# Altium schematic sheet Propulsion_v2.SchDoc
size A4
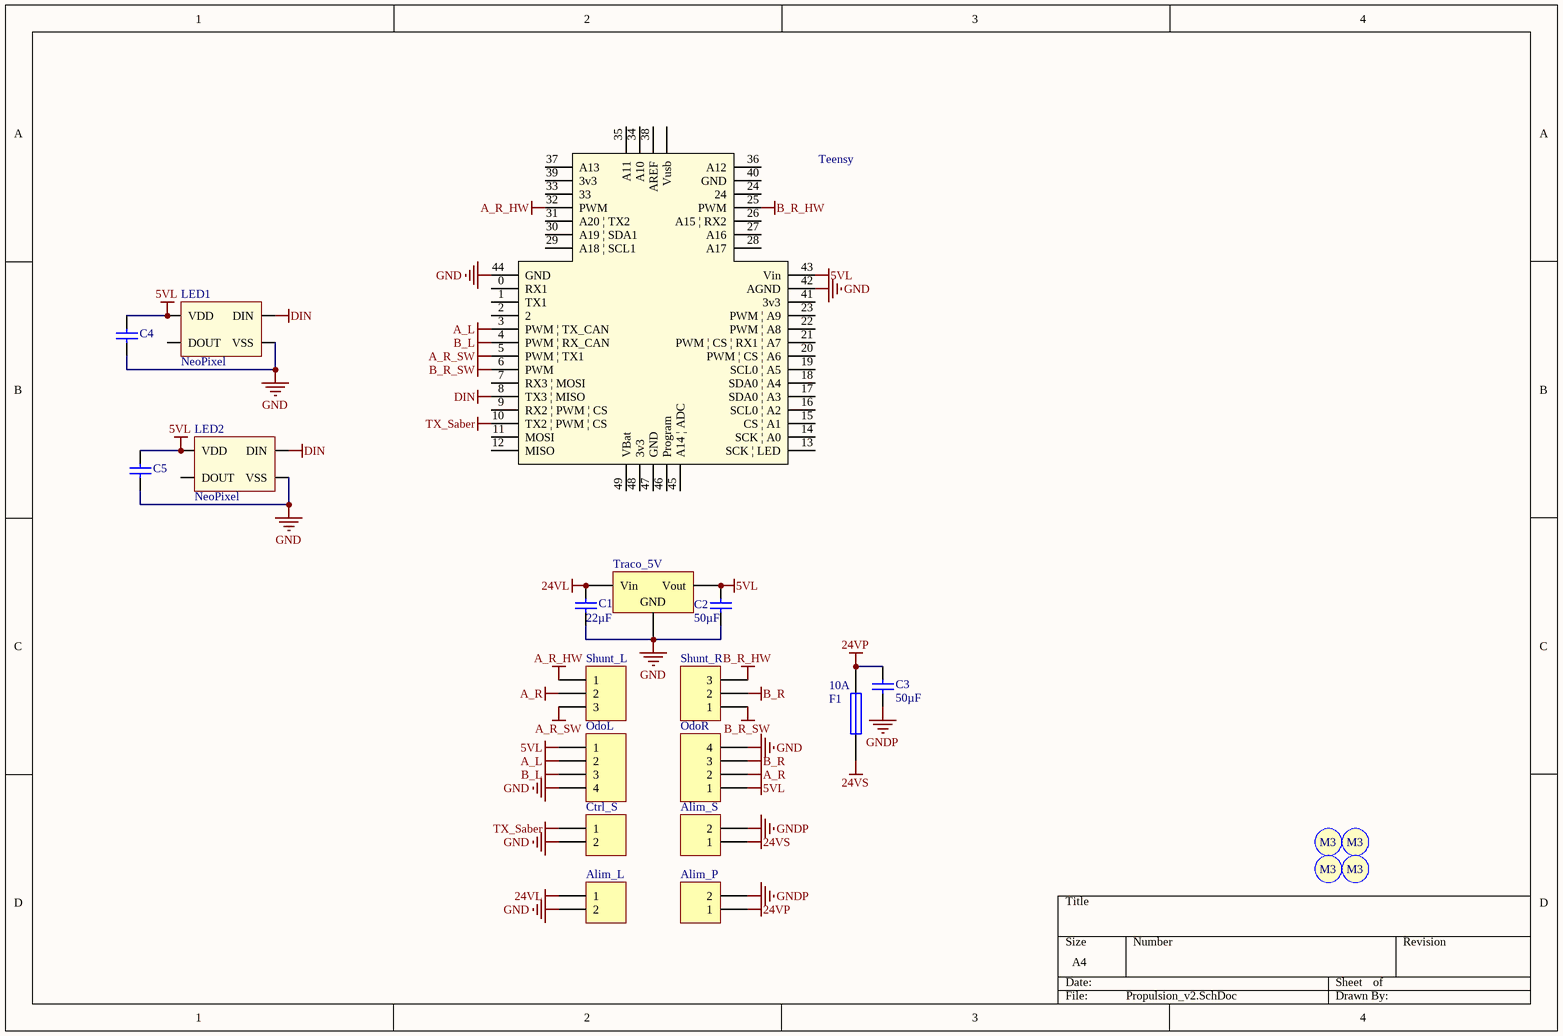
[diagram p0: Propulsion_v2.SchDoc]

## Parts
Alim_L  Minifit Jr 2x1H  [Molex_MiniFitJr_2x1H]  (value not drawn)
Alim_P  Minifit Jr 2x1H  [Molex_MiniFitJr_2x1H]  (value not drawn)
Alim_S  Minifit Jr 2x1H  [Molex_MiniFitJr_2x1H]  (value not drawn)
C1  value 22µF  [3.2X1.6X1.1]  (hidden comment: Cap22uF)
C2  value 50µF  [3.2X1.6X1.1]  (hidden comment: Cap50uF)
C3  value 50µF  [Condensateur]  (hidden comment: Cap50uF)
C4  Cap  [3.2X1.6X1.1]  (value not drawn)
C5  Cap  [3.2X1.6X1.1]  (value not drawn)
Ctrl_S  SPOX 2x1H  [Molex SPOX 2x1H]  (value not drawn)
F1  10A  [Fuse]
LED1  NeoPixel  [Neopixel]
LED2  NeoPixel  [Neopixel]
OdoL  SPOX 4x1H  [Molex SPOX 4x1H]  (value not drawn)
OdoR  SPOX 4x1H  [Molex SPOX 4x1H]  (value not drawn)
S1  Screw M3  [Screw M3]  (value not drawn)
S2  Screw M3  [Screw M3]  (value not drawn)
S3  Screw M3  [Screw M3]  (value not drawn)
S4  Screw M3  [Screw M3]  (value not drawn)
Shunt_L  Shunt selector  [HDR1X3]  (value not drawn)
Shunt_R  Shunt selector  [HDR1X3]  (value not drawn)
Teensy  Teensy 3.2  [teensy]  (value not drawn)
Traco_5V  Traco TRS2-2450  [TRS0.5]  (value not drawn)

## Nets
5VL: C2.1 C4.2 C5.2 LED1.3(VDD) LED2.3(VDD) OdoL.1 OdoR.1 Teensy.43(Vin) Traco_5V.3(Vout)
24VL: Alim_L.1 C1.2 Traco_5V.1(Vin)
24VP: Alim_P.1 C3.1 F1.2
24VS: Alim_S.1 F1.1
A_L: OdoL.2 Teensy.3(PWM_|_TX_CAN)
A_R: OdoR.2 Shunt_L.2
A_R_HW: Shunt_L.1 Teensy.32(PWM)
A_R_SW: Shunt_L.3 Teensy.5(PWM_|_TX1)
B_L: OdoL.3 Teensy.4(PWM_|_RX_CAN)
B_R: OdoR.3 Shunt_R.2
B_R_HW: Shunt_R.3 Teensy.25(PWM)
B_R_SW: Shunt_R.1 Teensy.6(PWM)
DIN: LED1.2(DIN) LED2.2(DIN) Teensy.8(TX3_|_MISO)
GND: Alim_L.2 C1.1 C2.2 C4.1 C5.1 Ctrl_S.2 LED1.1(VSS) LED2.1(VSS) OdoL.4 OdoR.4 Teensy.42(AGND) Teensy.44(GND) Traco_5V.2(GND)
GNDP: Alim_P.2 Alim_S.2 C3.2
TX_Saber: Ctrl_S.1 Teensy.10(TX2_|_PWM_|_CS)

Not connected (* = marked no-connect by the designer): LED1 4(DOUT); LED2 4(DOUT); Teensy 0(RX1) 1(TX1) 2 7(RX3_|_MOSI) 9(RX2_|_PWM_|_CS) 11(MOSI) 12(MISO) 13(SCK_|_LED) 14(SCK_|_A0) 15(CS_|_A1) 16(SCL0_|_A2) 17(SDA0_|_A3) 18(SDA0_|_A4) 19(SCL0_|_A5) 20(PWM_|_CS_|_A6) 21(PWM_|_CS_|_RX1_|_A7) 22(PWM_|_A8) 23(PWM_|_A9) 24 26(A15_|_RX2) 27(A16) 28(A17) 29(A18_|_SCL1) 30(A19_|_SDA1) 31(A20_|_TX2) 33 34(A10) 35(A11) 36(A12) 37(A13) 38(AREF) 39(3v3) 40(GND) 41(3v3) 45(A14_|_ADC) 46(Program) 47(GND) 48(3v3) 49(VBat) 50(Vusb)

## Notes on the sheet
- (in symbol Screw M3) M3

## Library data of the parts
Alim_L Alim_P Alim_S = Header 2: Molex Minifit Jr 2x1H; LatestRevisionDate: 17-Jul-2002; LatestRevisionNote: Re-released for DXP Platform.; Publisher: Altium Limited
C1-C3 = Cap: Capacitor; Max Voltage: 50V; Published: 8-Jun-2000; LatestRevisionDate: 17-Jul-2002; LatestRevisionNote: Re-released for DXP Platform.; PackageReference: RAD-0.3; Publisher: Altium Limited; PackageDescription: Radial Cap, Thru-Hole; 2 Leads; 0.3 in Pin Spacing
C4 C5 = Cap: Capacitor; Value: 22µF; Max Voltage: 50V; Published: 8-Jun-2000; LatestRevisionDate: 17-Jul-2002; LatestRevisionNote: Re-released for DXP Platform.; PackageReference: RAD-0.3; Publisher: Altium Limited; PackageDescription: Radial Cap, Thru-Hole; 2 Leads; 0.3 in Pin Spacing
Ctrl_S = Header 2: Molex SPOX Jr 2x1H; LatestRevisionDate: 17-Jul-2002; LatestRevisionNote: Re-released for DXP Platform.; Publisher: Altium Limited
F1 = Fuse 1: Fuse; Published: 8-Jun-2000; LatestRevisionDate: 17-Jul-2002; LatestRevisionNote: Re-released for DXP Platform.; PackageReference: PIN-W2/E2.8; Publisher: Altium Limited; PackageDescription: Thru-Hole; 2 Leads
OdoL OdoR = Header 4H: Molex SPOX 4x1H; LatestRevisionDate: 17-Jul-2002; LatestRevisionNote: Re-released for DXP Platform.; Publisher: Altium Limited
Shunt_L Shunt_R = Header 3: Header, 3-Pin; LatestRevisionDate: 17-Jul-2002; LatestRevisionNote: Re-released for DXP Platform.; Publisher: Altium Limited
Teensy = teensy3.2
Traco_5V = Volt Reg: Voltage Regulator; Published: 24-Mar-1999; LatestRevisionDate: 29-May-2009; LatestRevisionNote: IPC-7351 Footprint Added.; PackageReference: D2PAK; Publisher: Altium Limited; PackageDescription: 3-Pin Transistor Outline Package 2.54 mm Pitch, 15.1 mm Lead Span